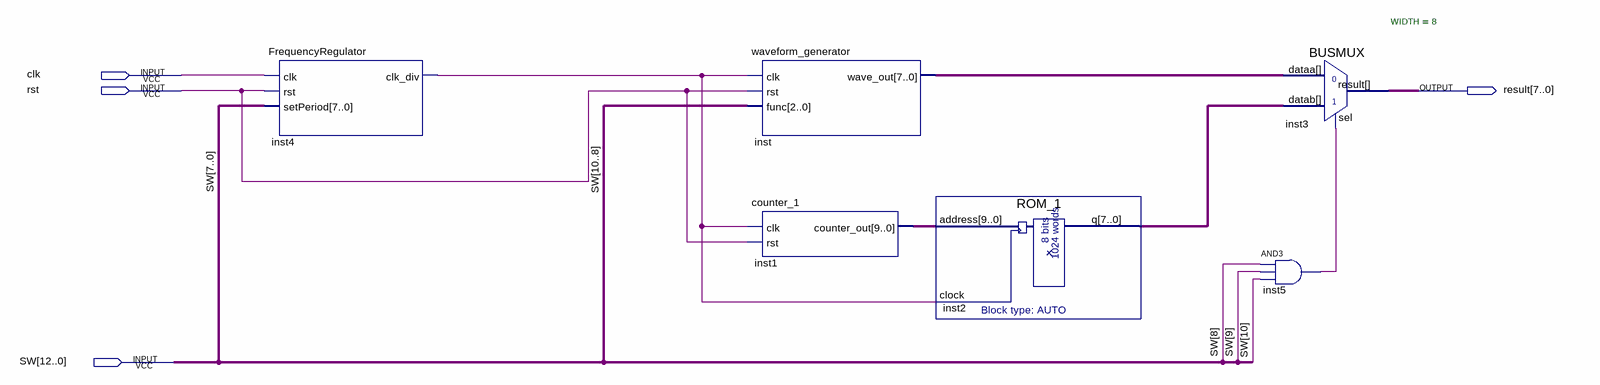
[diagram p0: schematic sheet]
// Quartus schematic WaveformGenerator.bdf as structural Verilog: 6 symbols, 4 pins
module WaveformGenerator (
  input  clk,
  input  rst,
  input  [12:0] SW,
  output [7:0] result
);

  wire inst4_clk_div, inst5_out;
  wire [7:0] inst2_q, inst_wave_out;
  wire [9:0] inst1_counter_out;

  FrequencyRegulator inst4 (.clk(clk), .rst(rst), .setPeriod(SW[7:0]), .clk_div(inst4_clk_div));
  waveform_generator inst (.clk(inst4_clk_div), .rst(rst), .func(SW[10:8]), .wave_out(inst_wave_out));
  counter_1 inst1 (.clk(inst4_clk_div), .rst(rst), .counter_out(inst1_counter_out));
  ROM_1 inst2 (.address(inst1_counter_out), .clock(inst4_clk_div), .q(inst2_q));
  and inst5 (inst5_out, SW[8], SW[9], SW[10]);
  BUSMUX #(.WIDTH(8)) inst3 (.datab(inst2_q), .sel(inst5_out), .dataa(inst_wave_out), .result(result));
endmodule
